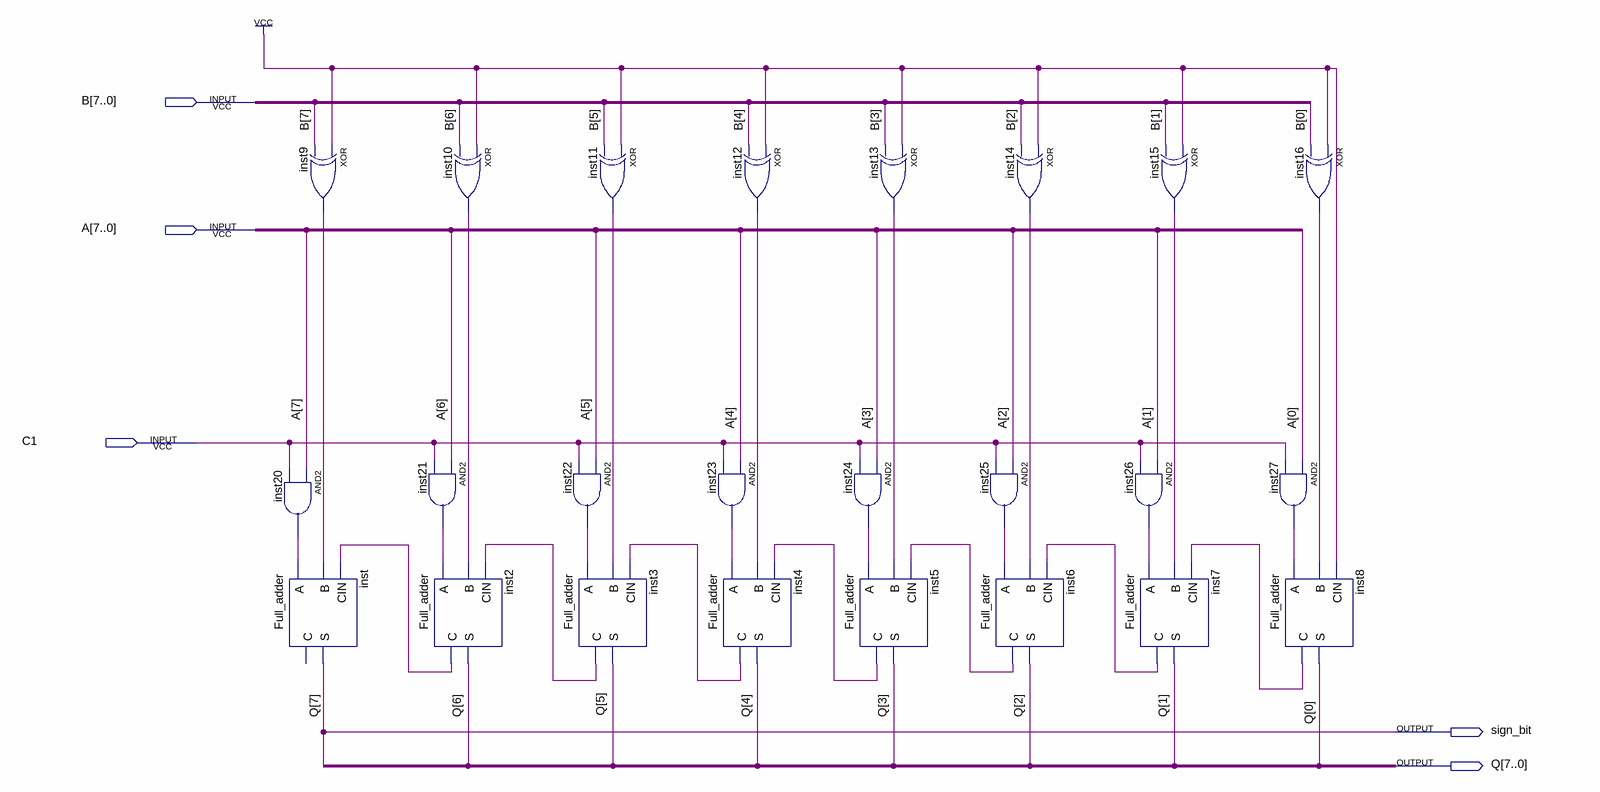
[diagram p0: schematic sheet]
// Quartus schematic SUB_MODULE.bdf as structural Verilog: 24 symbols, 5 pins
module SUB_MODULE (
  input  [7:0] B,
  input  [7:0] A,
  input  C1,
  output sign_bit,
  output [7:0] Q
);

  wire inst2_c, inst3_c, inst4_c, inst5_c, inst6_c, inst7_c, inst8_c, inst9_out, inst10_out, inst11_out,
       inst12_out, inst13_out, inst14_out, inst15_out, inst16_out, inst20_out, inst21_out, inst22_out,
       inst23_out, inst24_out, inst25_out, inst26_out, inst27_out;

  xor inst9 (inst9_out, 1'b1, B[7]);
  and inst20 (inst20_out, A[7], C1);
  Full_adder inst (.A(inst20_out), .B(inst9_out), .CIN(inst2_c), .S(Q[7]));  // open: C
  and inst21 (inst21_out, A[6], C1);
  Full_adder inst2 (.A(inst21_out), .B(inst10_out), .CIN(inst3_c), .S(Q[6]), .C(inst2_c));
  xor inst10 (inst10_out, 1'b1, B[6]);
  and inst22 (inst22_out, A[5], C1);
  Full_adder inst3 (.A(inst22_out), .B(inst11_out), .CIN(inst4_c), .S(Q[5]), .C(inst3_c));
  xor inst11 (inst11_out, 1'b1, B[5]);
  and inst23 (inst23_out, A[4], C1);
  Full_adder inst4 (.A(inst23_out), .B(inst12_out), .CIN(inst5_c), .S(Q[4]), .C(inst4_c));
  xor inst12 (inst12_out, 1'b1, B[4]);
  and inst24 (inst24_out, A[3], C1);
  Full_adder inst5 (.A(inst24_out), .B(inst13_out), .CIN(inst6_c), .S(Q[3]), .C(inst5_c));
  xor inst13 (inst13_out, 1'b1, B[3]);
  and inst25 (inst25_out, A[2], C1);
  Full_adder inst6 (.A(inst25_out), .B(inst14_out), .CIN(inst7_c), .S(Q[2]), .C(inst6_c));
  xor inst14 (inst14_out, 1'b1, B[2]);
  xor inst15 (inst15_out, 1'b1, B[1]);
  and inst26 (inst26_out, A[1], C1);
  Full_adder inst7 (.A(inst26_out), .B(inst15_out), .CIN(inst8_c), .S(Q[1]), .C(inst7_c));
  xor inst16 (inst16_out, 1'b1, B[0]);
  and inst27 (inst27_out, A[0], C1);
  Full_adder inst8 (.A(inst27_out), .B(inst16_out), .CIN(1'b1), .S(Q[0]), .C(inst8_c));

  assign sign_bit = Q[7];
endmodule
